# Altium schematic sheet DIGITAL_INPUT_2CH.SchDoc
size A
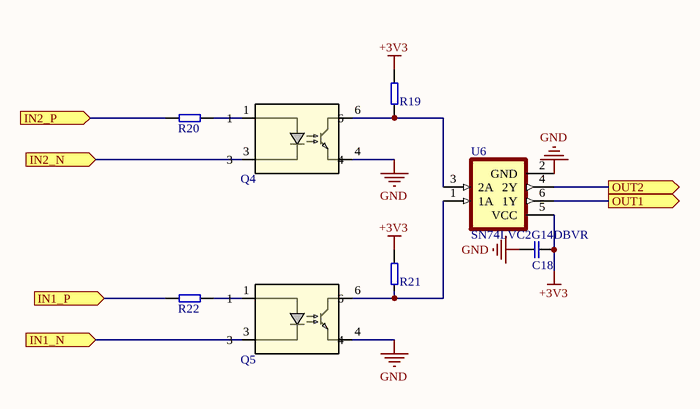
[diagram p0: DIGITAL_INPUT_2CH.SchDoc]

## Parts
C18  0.1uF  [C0402]  (value not drawn)
Q4  TLP188(TPL,E  [OptoCoupler]  (value not drawn)
Q5  TLP188(TPL,E(TPL,E  [OptoCoupler]  (value not drawn)
R19  1K  [R0402]  (value not drawn)
R20  1K  [R0402]  (value not drawn)
R21  1K  [R0402]  (value not drawn)
R22  1K  [R0402]  (value not drawn)
U6  SN74LVC2G14DBVR  [SOT95P280X145-6N]

## Ports
IN1_N (in), IN1_P (in), IN2_N (in), IN2_P (in), OUT1 (out), OUT2 (out)

## Nets
+3V3: C18.2 R19.2 R21.2 U6.5(VCC)
GND: C18.1 Q4.4 Q5.4 U6.2(GND)
IN1_N: Q5.3 ; port IN1_N
IN1_P: R22.2 ; port IN1_P
IN2_N: Q4.3 ; port IN2_N
IN2_P: R20.2 ; port IN2_P
OUT1: U6.6(1Y) ; port OUT1
OUT2: U6.4(2Y) ; port OUT2
NetQ4_1: Q4.1 R20.1
NetQ4_6: Q4.6 R19.1 U6.3(2A)
NetQ5_1: Q5.1 R22.1
NetQ5_6: Q5.6 R21.1 U6.1(1A)

## Library data of the parts
C18 = 04023C104KAT2A: CAP CER 0.1UF 25V X7R 0402; Manufacturer: AVX Corporation; Que: 009; Tolerance: ±10%; Type: Ceramic; Name: Recep Aydin; Part Number: 04023C104KAT2A; Voltage: 25V; Temperature Coefficient: X7R; Package: 0402(1005 Metric); Datasheet: https://datasheets.avx.com/X7RDielectric.pdf; Manufacturer Part Number: 04023C104KAT2A
Q4 Q5 = TLP188(TPL,E: IC-188 OPTOISO 3.75KV TRANS SO6; Mfr_Name: Toshiba Electronic Devices & Storage Corp.; Type: DEV; Number_devices_in_Package: 1; Que: 012; Copyright: Copyright (C) 2023 Ultra Librarian. All rights reserved.; Manufacturer_Part_Number: TLP188(TPL,E; RefDes: RefDes; Source_Package: TLP188; Part Number: TLP188(TPL,E
R19-R22 = RT0402BRE071KL: RES SMD 1K OHM 0.1% 1/16W 0402; Manufacturer: Yageo; Que: 015; Name: Recep Aydin; Part Number: RT0402BRE071KL; Tolerance: 0.1%; Resistor Type: Thick Film; Package: 0402; Datasheet: https://www.yageo.com/upload/media/product/productsearch/datasheet/rchip/PYu-RT_1-to-0.01_RoHS_L_12.pdf; Manufacturer Part Number: RT0402BRE071KL
U6 = SN74LVC2G14DBVR: Dual Schmitt-Trigger Inverter 6-SOT-23 -40 to 125; MF: Texas Instruments; Value: *; SnapEDA_Link: https://www.snapeda.com/parts/SN74LVC2G14DBVR/Texas%20Instruments/view-part/77482/?ref=snap; Texas_Instruments-Purchase-URL: https://snapeda.com/shop?store=Texas+Instruments&id=77482; Mouser-Purchase-URL: https://snapeda.com/shop?store=Mouser&id=77482; Price: None; Availability: Unavailable; Package: SOT-23-6 Texas Instruments; DigiKey-Purchase-URL: https://snapeda.com/shop?store=DigiKey&id=77482; MP: SN74LVC2G14DBVR